# Altium schematic sheet Diff-Probe-Supply.SchDoc
size A3; SheetNumber: 2; SheetTotal: 2
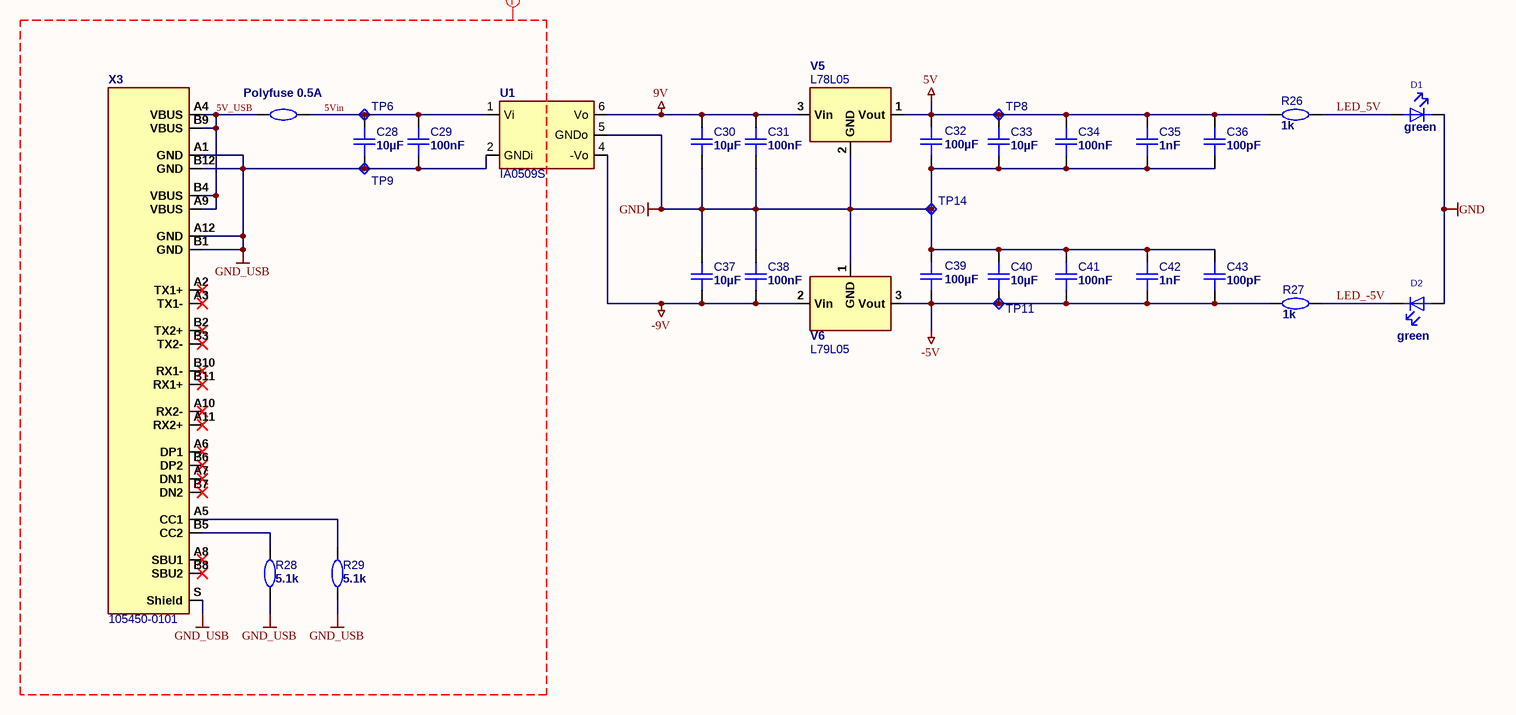
[diagram p0: Diff-Probe-Supply.SchDoc]

## Parts
C28  value 10µF  [C-0805_2012_155_L_RF]  (hidden comment: Cap 10u 0805)
C29  value 100nF  [C-0603_1608_095_L_RF]  (hidden comment: Cap 100n 0603)
C30  value 10µF  [C-0805_2012_155_L_RF]  (hidden comment: Cap 10u 0805)
C31  value 100nF  [C-0603_1608_095_L_RF]  (hidden comment: Cap 100n 0603)
C32  value 100µF  [C-1206_3216_180_L_RF]  (hidden comment: Cap 100u 6.3V 1206)
C33  value 10µF  [C-0805_2012_155_L_RF]  (hidden comment: Cap 10u 0805)
C34  value 100nF  [C-0603_1608_095_L_RF]  (hidden comment: Cap 100n 0603)
C35  value 1nF  [C-0603_1608_100_L_RF]  (hidden comment: Cap 1n 0603)
C36  value 100pF  [C-0603_1608_095_L_RF]  (hidden comment: Cap 100p 0603)
C37  value 10µF  [C-0805_2012_155_L_RF]  (hidden comment: Cap 10u 0805)
C38  value 100nF  [C-0603_1608_095_L_RF]  (hidden comment: Cap 100n 0603)
C39  value 100µF  [C-1206_3216_180_L_RF]  (hidden comment: Cap 100u 6.3V 1206)
C40  value 10µF  [C-0805_2012_155_L_RF]  (hidden comment: Cap 10u 0805)
C41  value 100nF  [C-0603_1608_095_L_RF]  (hidden comment: Cap 100n 0603)
C42  value 1nF  [C-0603_1608_100_L_RF]  (hidden comment: Cap 1n 0603)
C43  value 100pF  [C-0603_1608_095_L_RF]  (hidden comment: Cap 100p 0603)
D1  value green  [LED-0603_1608_Green_L_RF]  (hidden comment: LED SMD 0603 Green)
D2  value green  [LED-0603_1608_Green_L_RF]  (hidden comment: LED SMD 0603 Green)
R25  Res 0R 0805  [R-0805_2012_060_L_RF]  (value not drawn)
R26  value 1k  [R-0603_1608_050_L_RF]  (hidden comment: Res 1k 0603)
R27  value 1k  [R-0603_1608_050_L_RF]  (hidden comment: Res 1k 0603)
R28  value 5.1k  [R-0603_1608_050_L_RF]  (hidden comment: Res 5k1 0603)
R29  value 5.1k  [R-0603_1608_050_L_RF]  (hidden comment: Res 5k1 0603)
TP6  TestPoint 1.6mm with via  [TP_1.6mm_via]  (value not drawn)  (no BOM)
TP8  TestPoint 1.6mm with via  [TP_1.6mm_via]  (value not drawn)  (no BOM)
TP9  TestPoint 1.6mm with via  [TP_1.6mm_via]  (value not drawn)  (no BOM)
TP11  TestPoint 1.6mm with via  [TP_1.6mm_via]  (value not drawn)  (no BOM)
TP14  TestPoint 1.6mm with via  [TP_1.6mm_via]  (value not drawn)  (no BOM)
U1  IA0509S  [SIP7]
V5  L78L05  [SOT-89-3]
V6  L79L05  [SOT-89-3]
X3  105450-0101  [105450-0101]

## Nets
5V: C32.1 C33.2 C34.2 C35.2 C36.2 R26.2 TP8.1 V5.1(Vout)
9V: C30.2 C31.2 U1.6(Vo) V5.3(Vin)
-5V: C39.2 C40.1 C41.1 C42.1 C43.1 R27.1 TP11.1 V6.3(Vout)
-9V: C37.1 C38.1 U1.4(-Vo) V6.2(Vin)
GND: C30.1 C31.1 C32.2 C33.1 C34.1 C35.1 C36.1 C37.2 C38.2 C39.1 C40.2 C41.2 C42.2 C43.2 D1.2 D2.1 TP14.1 U1.5(GNDo) V5.2(GND) V6.1(GND)
GND_USB: C28.1 C29.1 R28.1 R29.1 TP9.1 U1.2(GNDi) X3.A1(GND) X3.A12(GND) X3.B1(GND) X3.B12(GND) X3.S(Shield)
5V_USB: R25.1 X3.A4(VBUS) X3.A9(VBUS) X3.B4(VBUS) X3.B9(VBUS)
5Vin: C28.2 C29.2 R25.2 TP6.1 U1.1(Vi)
LED_5V: D1.1 R26.1
LED_-5V: D2.2 R27.2
NetR28_2: R28.2 X3.B5(CC2)
NetR29_2: R29.2 X3.A5(CC1)

Not connected (* = marked no-connect by the designer): X3 A2(TX1+)* A3(TX1-)* A6(DP1)* A7(DN1)* A8(SBU1)* A10(RX2-)* A11(RX2+)* B2(TX2+)* B3(TX2-)* B6(DP2)* B7(DN2)* B8(SBU2)* B10(RX1-)* B11(RX1+)*

## Layout directives
net class Supply: 5V_USB, 5Vin, GND_USB

## Notes on the sheet
- (near R25) Polyfuse 0.5A
- DWG. NO.
- REV.
- SHT.
- REVISION
- DESCRIPTION
- DATE
- APPROVED
- THIS DOCUMENT AND THE DATA DISCLOSED HEREIN OR HEREWITH IS THE PROPERTY OF ALTIUM LIMITED AND MAY BE FREELY DISTRIBUTED IN WHOLE. NO RIGHTS ARE RESERVED OR EXPRESS OR IMPLIED WARANTEE GIVEN.
- ENG:
- DSN:
- APPROVALS
- PROJECT
- DOCUMENT REVISION:
- DESIGN ITEM:
- CHK:
- BOM:
- REFERENCE DOCUMENTS
- PROJECT REVISION:
- TITLE
- FAB DWG:
- PCB DWG:
- ASSY DWG:
- SCALE:
- SIZE
- C
- CAGE CODE
- FILE NAME
- DWG NO.
- SHEET
- OF
- REV

## Library data of the parts
C28 C30 C33 C37 C40 = CMP-001-0018-2: Cap Cer SMD 10u 6.3V 10% 0805 X7R; Manufacturer: MURATA; Manufacturer Part Number: GCM21BR70J106KE22; GPV_Number: 1750.0267; User: zupa; Prefered: false; ComponentLink1URL: https://datasheet.ciiva.com/11607/product-11607500.pdf; Technology: SMT; ComponentLink1Description: Datasheet; PartStatus: Release; Case / Package: 0805; ClassName: Surface_Assy
C29 C31 C34 C38 C41 = CMP-001-0036-2: Cap Cer SMD 100n 100V 10% 0603 X7R; Manufacturer Part Number: GRM188R72A104KA35; Manufacturer: MURATA; GPV_Number: 1749.0196; User: zupa; Prefered: false; Case / Package: 0603; ComponentLink1Description: Datasheet; PartStatus: Release; ComponentLink1URL: https://datasheet.ciiva.com/34302/1857815-34302863.pdf; ClassName: Surface_Assy; Technology: SMT
C32 C39 = CMP-00025-1: Cap Cer SMD 100u 6.3V 20% 1206 X5R; Manufacturer: AVX; Manufacturer Part Number: 12066D107MAT2A; Prefered: false; User: balu; ComponentLink1Description: Datasheet; ComponentLink1URL: http://datasheets.avx.com/cx5r.pdf?src-supplier=Digi-Key; Case / Package: 1206; Technology: SMT; PartStatus: Release; GPV_Number: *; ClassName: Surface_Assy
C35 C42 = CMP-001-0174-2: Cap Cer SMD 1n 50V 1% 0603 C0G; Manufacturer Part Number: 06035A102FAT*; Manufacturer: AVX; Prefered: true; GPV_Number: 1749.0018; User: zupa; PartStatus: Release; Technology: SMT; ComponentLink1Description: Datasheet; Case / Package: 0603; ComponentLink1URL: https://datasheet.ciiva.com/26939/getdatasheetpartid-734047-26939692.pdf; ClassName: Surface_Assy
C36 C43 = CMP-001-0000-2: Cap Cer SMD 100p 50V 5% 0603 C0G; Manufacturer Part Number: CC0603J*NPO9BN101; Manufacturer: YAGEO; User: zupa; GPV_Number: 1749.0055; Prefered: false; Technology: SMT; PartStatus: Release; Case / Package: 0603; ComponentLink1Description: Datasheet; ComponentLink1URL: https://datasheet.ciiva.com/11786/0900766b8079c870-11786060.pdf; ClassName: Surface_Assy
D1 D2 = CMP-001-1208-7: LED Green LTST-C190KGKT 0603; Manufacturer: Lite-On Inc; User: epph; GPV_Number: 1602.0827; Case / Package: 0603; PartStatus: Release; Technology: SMT; ClassName: Surface_Assy; Manufacturer Part Number: LTST-C190KGKT
R25 = CMP-001-0287-3: Res SMD 0R 1% 0.125W 0805; Manufacturer Part Number: RC0805JR-070RL; Manufacturer: YAGEO; User: zupa; Prefered: true; MNL_Number: 15500000; GPV_Number: 1930.0000; Value: 0R; Technology: SMT; ComponentLink1URL: https://datasheet.ciiva.com/11819/0900766b8106beab-11819430.pdf; ComponentLink1Description: Datasheet; ClassName: Surface_Assy; PartStatus: Release
R26 R27 = CMP-001-0250-3: Res SMD 1k 1% 0.1W 0603; Manufacturer: YAGEO; Manufacturer Part Number: RC0603FR-071KL; Prefered: true; User: zupa; GPV_Number: 1922.0011; MNL_Number: 15310012; ComponentLink1Description: Datasheet; ComponentLink1URL: https://datasheet.ciiva.com/11808/0900766b80f96399-11808280.pdf; PartStatus: Release; ClassName: Surface_Assy; Technology: SMT; Case / Package: 0603
R28 R29 = CMP-001-0582-3: Res SMD 5k1 1% 0.1W 0603; Manufacturer Part Number: RC0603FR-075K1L; Manufacturer: YAGEO; Prefered: true; GPV_Number: 1922.0144; User: napa; Technology: SMT; ComponentLink1URL: https://datasheet.ciiva.com/8895/pyu-rc0603-51-rohs-l-4-8895189.pdf; PartStatus: Release; ClassName: Surface_Assy; ComponentLink1Description: Datasheet; Case / Package: 0603
TP6 TP8 TP9 TP11 TP14 = CMP-00087-1: TestPoint 1.6mm with via v70h30; User: epph; Value: TP; GPV_Number: -; ClassName: Testpoint; PartStatus: Release; Technology: SMT
U1 = IA0509S: IC DC/DC Converter 5VIN +-9VOUT 1W; Part_validated: No; Manufacturer: XP Power; MNL_Number: xxxxxxxx; GPV_Number: -; Value: IA0509S; Footprint_validated: No; PartStatus: New; System: -; ClassName: Through-Hole_Assy; Case/Package: 7-SIP; Technology: THT; Manufacturer Part Number: IA0509S; Supplier 1: Farnell; Supplier Part Number 1: 1860943
V5 = L78L05: IC REG 5V SOT-89-3; Part_validated: No; Manufacturer: ST; GPV_Number: xxxx.xxxx; MNL_Number: xxxxxxxx; Value: L78L05; Footprint_validated: No; PartStatus: New; System: -; ClassName: Surface_Assy; Case/Package: SOT-89-3; Technology: SMT; Manufacturer Part Number: L78L05
V6 = L79L05: IC REG -5V SOT-89-3; Part_validated: No; Manufacturer: ST; GPV_Number: xxxx.xxxx; MNL_Number: xxxxxxxx; Value: L79L05; Footprint_validated: No; PartStatus: New; System: -; ClassName: Surface_Assy; Case/Package: SOT-89-3; Technology: SMT; Manufacturer Part Number: L79L05
X3 = 105450-0101: CONN USB-C 16pin; Part_validated: No; Manufacturer: Molex; GPV_Number: xxxx.xxxx; System: Connector; MNL_Number: xxxxxxxx; Value: 105450-0101; Footprint_validated: No; PartStatus: New; ClassName: Through-Hole_Assy; Case/Package: USB-C; Technology: SMT; Manufacturer Part Number: 105450-0101